# EAGLE design 4xthermocoupleshield (EAGLE 7.5.0)
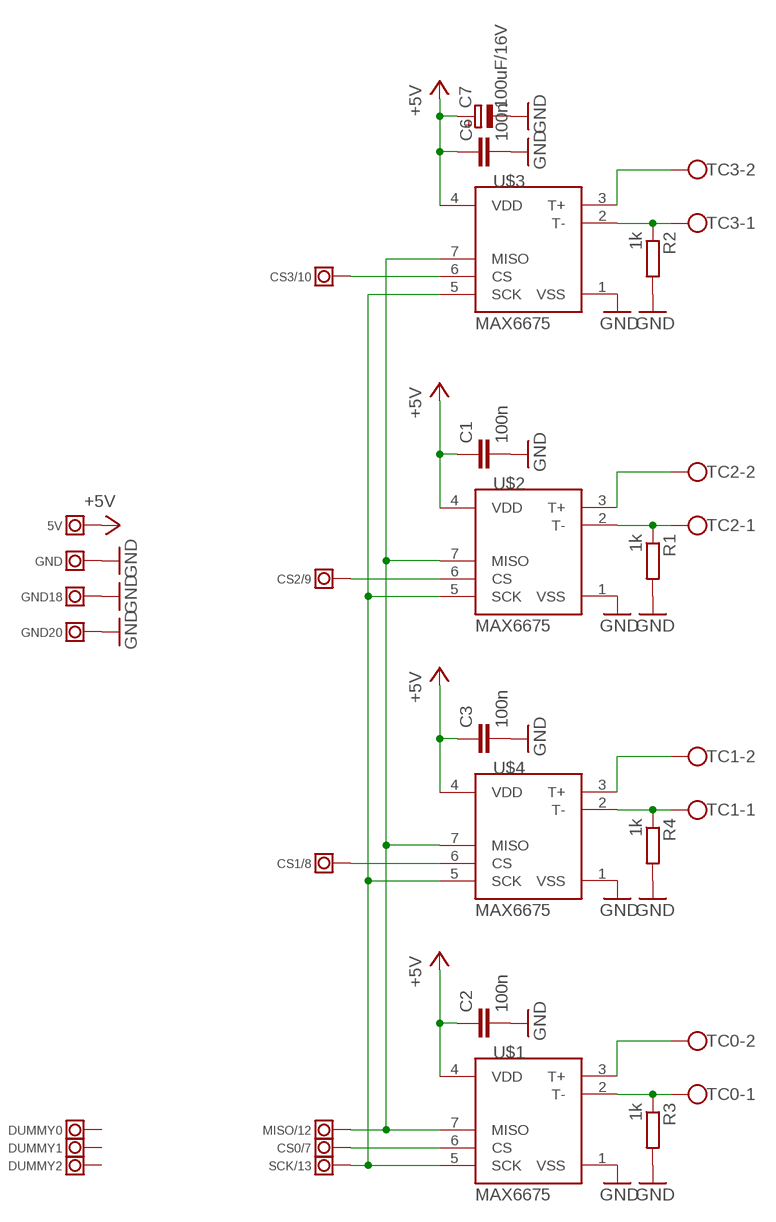
[diagram p0: schematic, sheet 1]

## Parts
5V  PIN-HEADER  [PIN-HEADER-MALE]
C1  100n  C-EUC0603  [C0603]
C2  100n  C-EUC0603  [C0603]
C3  100n  C-EUC0603  [C0603]
C6  100n  C-EUC0603  [C0603]
C7  100uF/16V  CPOL-EUE2.5-7  [E2,5-7]
CS0/7  PIN-HEADER  [PIN-HEADER-MALE]
CS1/8  PIN-HEADER  [PIN-HEADER-MALE]
CS2/9  PIN-HEADER  [PIN-HEADER-MALE]
CS3/10  PIN-HEADER  [PIN-HEADER-MALE]
DUMMY0  PIN-HEADER  [PIN-HEADER-MALE]
DUMMY1  PIN-HEADER  [PIN-HEADER-MALE]
DUMMY2  PIN-HEADER  [PIN-HEADER-MALE]
GND  PIN-HEADER  [PIN-HEADER-MALE]
GND18  PIN-HEADER  [PIN-HEADER-MALE]
GND20  PIN-HEADER  [PIN-HEADER-MALE]
MISO/12  PIN-HEADER  [PIN-HEADER-MALE]
R1  1k  R-EU_R0603  [R0603]
R2  1k  R-EU_R0603  [R0603]
R3  1k  R-EU_R0603  [R0603]
R4  1k  R-EU_R0603  [R0603]
SCK/13  PIN-HEADER  [PIN-HEADER-MALE]
TC0  W237-102  [W237-102]
TC1  W237-102  [W237-102]
TC2  W237-102  [W237-102]
TC3  W237-102  [W237-102]
U$1  MAX6675  [SO08-MAX6675]
U$2  MAX6675  [SO08-MAX6675]
U$3  MAX6675  [SO08-MAX6675]
U$4  MAX6675  [SO08-MAX6675]

## Nets
+5V: 5V.P$1 C1.1 C2.1 C3.1 C6.1 C7.+ U$1.4(VDD) U$2.4(VDD) U$3.4(VDD) U$4.4(VDD)
GND: C1.2 C2.2 C3.2 C6.2 C7.- GND18.P$1 GND20.P$1 GND.P$1 R1.2 R2.2 R3.2 R4.2 U$1.1(VSS) U$2.1(VSS) U$3.1(VSS) U$4.1(VSS)
N$1: TC0.2 U$1.3(T+)
N$2: R1.1 TC2.1 U$2.2(T-)
N$4: TC2.2 U$2.3(T+)
N$6: CS2/9.P$1 U$2.6(CS)
N$9: R2.1 TC3.1 U$3.2(T-)
N$10: MISO/12.P$1 U$1.7(MISO) U$2.7(MISO) U$3.7(MISO) U$4.7(MISO)
N$13: R3.1 TC0.1 U$1.2(T-)
N$14: CS0/7.P$1 U$1.6(CS)
N$16: SCK/13.P$1 U$1.5(SCK) U$2.5(SCK) U$3.5(SCK) U$4.5(SCK)
N$17: TC3.2 U$3.3(T+)
N$18: R4.1 TC1.1 U$4.2(T-)
N$19: CS3/10.P$1 U$3.6(CS)
N$20: TC1.2 U$4.3(T+)
N$22: CS1/8.P$1 U$4.6(CS)
Unconnected: DUMMY0.P$1 DUMMY1.P$1 DUMMY2.P$1

## Library data of the parts
5V CS0/7 CS1/8 CS2/9 CS3/10 DUMMY0 DUMMY1 DUMMY2 GND GND18 GND20 MISO/12 SCK/13 = mrrcomps:PIN-HEADER
C1-C3 C6 = rcl:C-EU: CAPACITOR, European symbol
C7 = rcl:CPOL-EU: POLARIZED CAPACITOR, European symbol
R1-R4 = rcl:R-EU_: RESISTOR, European symbol
TC0 TC1-TC3 = mrrcomps:W237-102: WAGO SCREW CLAMP
U$1-U$4 = SparkFun-AnalogIC:MAX6675: K-type thermocouple ADC, SPI output

## Net classes
2 gnd: width 0.203 mm, drill 0.559 mm, clearance 0.203 mm

## Board
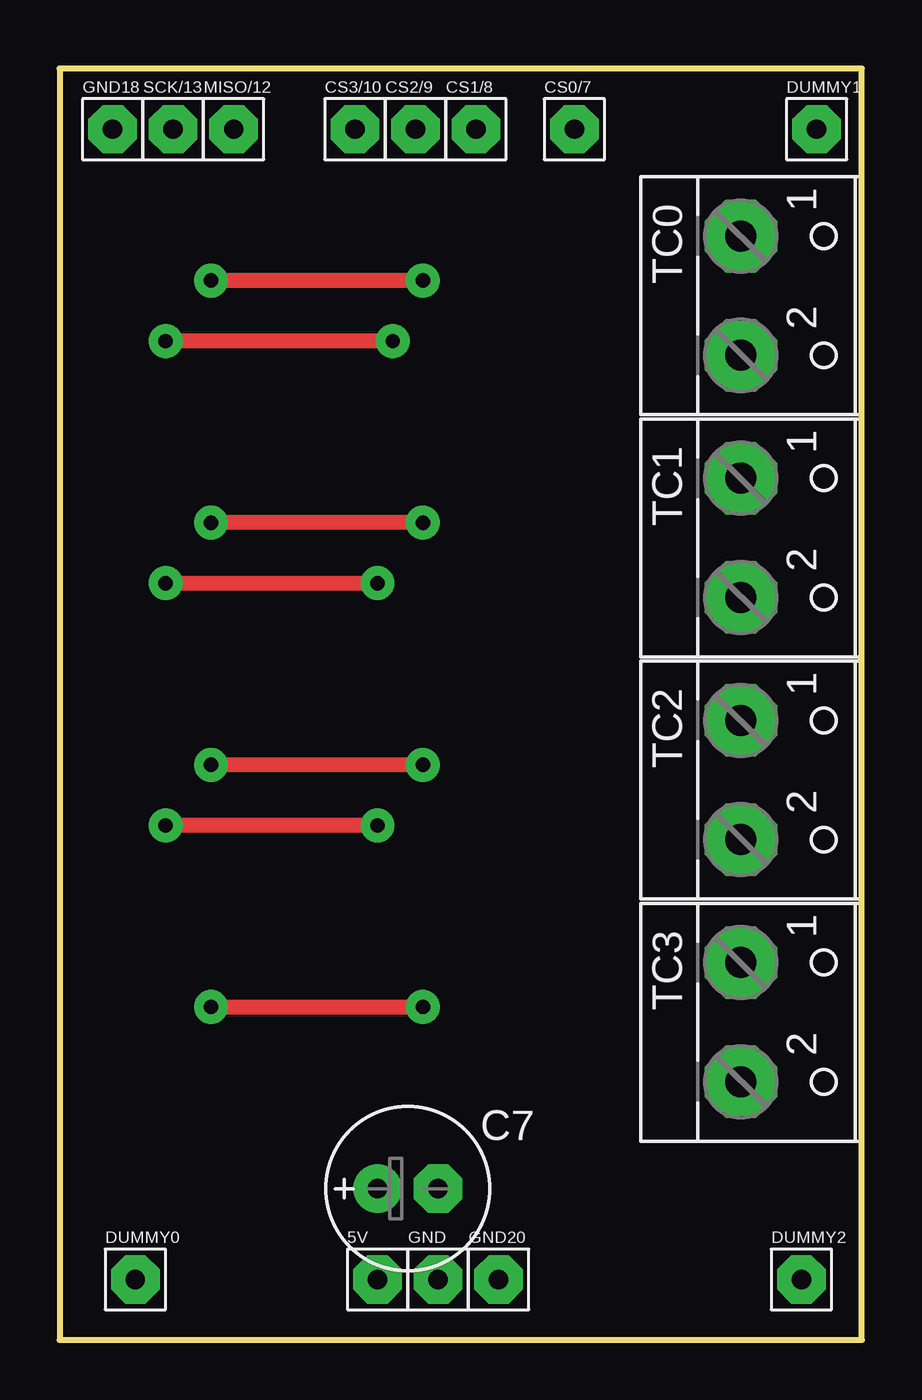
[diagram p1: board, top side]
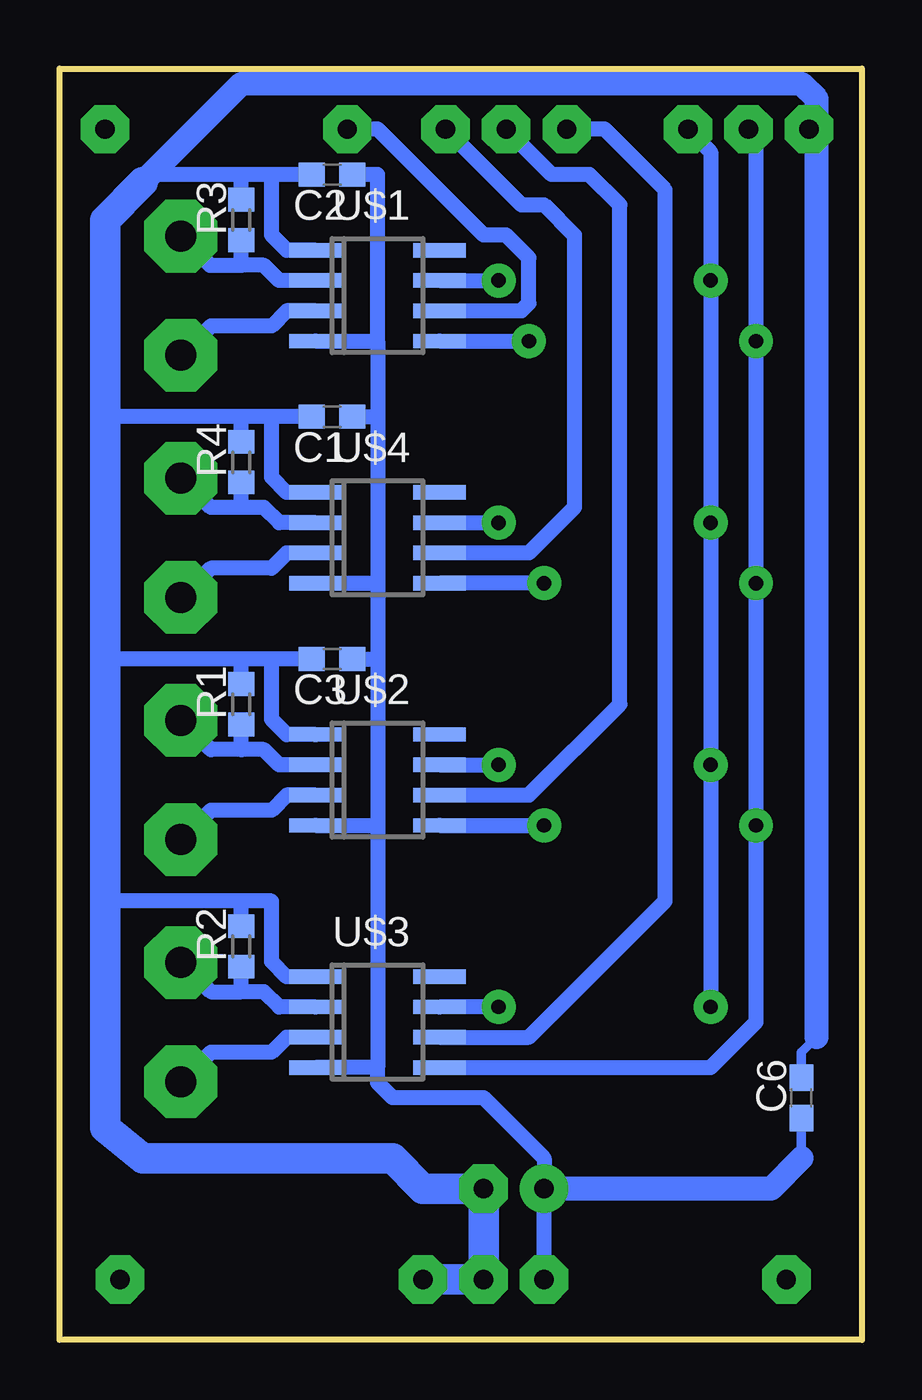
[diagram p2: board, bottom side, seen from below]

Size 33.66 x 53.34 mm. Coordinates in mm from the lower left corner, seen from the top.
Outline: 33.66,53.34 0,53.34 0,0 33.66,0 33.66,53.34
Copper layers (1*16): Top 0.035mm / dielectric 1.5mm / Bottom 0.035mm
Design rules "ArduinoUno *": minimum track width 12mil, minimum drill 32mil, track to track 12mil, track to pad 12mil, pad to pad 12mil, via to via 12mil, smd to smd 12mil, copper to edge 32mil, drill to drill 16mil, minimum pad ring 10mil, minimum via ring 10mil, stop-mask expansion 2mil, vias tented up to drill 30mil, thermal gap 10mil

### Footprints (pad centres in the part's own frame; a part is rotated, then mirrored left to right if it is on the bottom)
PIN-HEADER-MALE = drill 0.813 pad 2.032 octagon: P$1 0,0
C0603 = smd 1.1 x 1: 1 -0.85,0; 2 0.85,0
E2,5-7 = drill 0.813 pad 2.032: + -1.27,0 | drill 0.813 pad 2.032 octagon: - 1.27,0
R0603 = smd 1 x 1.1: 1 -0.85,0; 2 0.85,0
W237-102 = drill 1.3 pad 3.048 octagon: 1 -2.5,-1.27; 2 2.5,-1.27
SO08-MAX6675 = smd 0.6 x 2.2: 1 -1.905,-2.6; 2 -0.635,-2.6; 3 0.635,-2.6; 4 1.905,-2.6; 5 1.905,2.6; 6 0.635,2.6; 7 -0.635,2.6; 8 -1.905,2.6

### Placement (x,y rotation side)
5V  13.34,2.54 0 top
C1  22.23,38.73 180 bottom
C2  22.23,48.9 180 bottom
C3  22.23,28.57 180 bottom
C6  2.54,10.16 90 bottom
C7  14.61,6.35 0 top
CS0/7  21.59,50.8 0 top
CS1/8  17.46,50.8 0 top
CS2/9  14.92,50.8 0 top
CS3/10  12.38,50.8 0 top
DUMMY0  3.17,2.54 0 top
DUMMY1  31.75,50.8 0 top
DUMMY2  31.11,2.54 0 top
GND  15.88,2.54 0 top
GND18  2.22,50.8 0 top
GND20  18.41,2.54 0 top
MISO/12  7.3,50.8 0 top
R1  26.04,26.67 90 bottom
R2  26.04,16.51 90 bottom
R3  26.04,46.99 90 bottom
R4  26.04,36.83 90 bottom
SCK/13  4.76,50.8 0 top
TC0  29.84,43.81 270 top
TC1  29.84,33.66 270 top
TC2  29.84,23.5 270 top
TC3  29.84,13.34 270 top
U$1  20.32,43.81 270 bottom
U$2  20.32,23.5 270 bottom
U$3  20.32,13.34 270 bottom
U$4  20.32,33.66 270 bottom

### Tracks (layer width: path | path; a pad name or v marks a point on that pad's centre or on a via)
+5V
  Bottom 0.406: C6.1 2.54,7.62
  Bottom 0.635: 20.32,11.43 20.32,10.79 19.68,10.16 15.88,10.16 13.34,7.62 C7.+ 5V.P$1 | 20.32,11.43 U$3.4 | U$2.4 20.32,21.59 | 20.32,21.59 20.32,11.43 | U$4.4 20.32,31.75 | 20.32,31.75 20.32,28.57 | 20.32,28.57 20.32,21.59 | U$1.4 20.32,41.91 | 20.32,41.91 20.32,38.73 | 20.32,38.73 20.32,31.75 | 20.32,41.91 20.32,48.9 C2.1 | C1.1 20.32,38.73 | C3.1 20.32,28.57
  Bottom 1.016: 2.54,7.62 3.81,6.35 C7.+
GND
  Bottom 0.406: GND18.P$1 1.91,50.8 | C6.2 2.54,12.06 1.91,12.7
  Bottom 0.635: 26.04,18.41 24.77,18.41 24.77,15.88 24.13,15.24 U$3.1 | 26.04,18.41 31.75,18.41 | R2.2 26.04,18.41 | U$2.1 24.13,25.4 24.77,26.04 24.77,28.57 | 24.77,28.57 26.04,28.57 | 26.04,28.57 31.75,28.57 | R1.2 26.04,28.57 | C3.2 24.77,28.57 | U$4.1 24.13,35.56 24.77,36.2 24.77,38.73 | 24.77,38.73 26.04,38.73 | 26.04,38.73 31.75,38.73 | R4.2 26.04,38.73 | C1.2 24.77,38.73 | U$1.1 24.13,45.72 24.77,46.35 24.77,48.9 | 24.77,48.9 26.04,48.9 | 26.04,48.9 29.84,48.9 30.16,48.58 | R3.2 26.04,48.9 | C2.2 24.77,48.9
  Bottom 1.016: 29.84,48.9 26.04,52.7 2.54,52.7 1.91,52.07 1.91,50.8 1.91,12.7
  Bottom 1.27: GND20.P$1 GND.P$1 C7.- 18.41,6.35 19.68,7.62 30.16,7.62 31.75,8.89 31.75,18.41 31.75,28.57 31.75,38.73 31.75,46.99 30.16,48.58
N$1
  Bottom 0.635: U$1.3 24.13,43.18 24.77,42.55 27.3,42.55 28.54,41.31 TC0.2
N$2
  Bottom 0.635: U$2.2 24.45,24.13 25.08,24.77 26.04,24.77 | 26.04,24.77 27.3,24.77 28.54,26 TC2.1 | 26.04,24.77 R1.1
N$4
  Bottom 0.635: U$2.3 24.13,22.86 24.77,22.23 27.3,22.23 28.54,21 TC2.2
N$6
  Bottom 0.635: U$2.6 13.97,22.86 10.16,26.67 10.16,47.62 11.43,48.9 13.02,48.9 CS2/9.P$1
N$9
  Bottom 0.635: U$3.2 24.45,13.97 25.08,14.61 26.04,14.61 | TC3.1 28.54,15.84 27.3,14.61 26.04,14.61 | 26.04,14.61 R2.1
N$10  (via drill 0.6 pad 1.42)
  Top 0.635: v15.24,44.45 v6.35,44.45 | v6.35,13.97 v15.24,13.97 | v15.24,24.13 v6.35,24.13 | v15.24,34.29 v6.35,34.29
  Bottom 0.635: U$1.7 v15.24,44.45 | MISO/12.P$1 6.35,49.85 v6.35,44.45 v6.35,34.29 v6.35,24.13 v6.35,13.97 | v15.24,13.97 U$3.7 | U$2.7 v15.24,24.13 | U$4.7 v15.24,34.29
N$13
  Bottom 0.635: U$1.2 24.45,44.45 25.08,45.09 26.04,45.09 | 26.04,45.09 R3.1 | TC0.1 27.34,45.09 26.04,45.09
N$14
  Bottom 0.635: U$1.6 14.29,43.18 13.97,43.5 13.97,45.4 14.92,46.35 15.88,46.35 20.32,50.8 CS0/7.P$1
N$16  (via drill 0.6 pad 1.42)
  Top 0.635: v13.97,41.91 v4.45,41.91 | v13.34,21.59 v4.45,21.59 | v4.45,31.75 v13.34,31.75
  Bottom 0.635: U$1.5 v13.97,41.91 | U$2.5 v13.34,21.59 | SCK/13.P$1 4.76,50.48 4.45,50.16 v4.45,41.91 v4.45,31.75 v4.45,21.59 4.45,13.34 6.35,11.43 U$3.5 | v13.34,31.75 U$4.5
N$17
  Bottom 0.635: U$3.3 24.13,12.7 24.77,12.06 27.3,12.06 28.54,10.84 TC3.2
N$18
  Bottom 0.635: U$4.2 24.45,34.29 25.08,34.92 26.04,34.92 | 26.04,34.92 27.3,34.92 28.54,36.16 TC1.1 | 26.04,34.92 R4.1
N$19
  Bottom 0.635: U$3.6 13.97,12.7 8.26,18.41 8.26,48.26 10.79,50.8 CS3/10.P$1
N$20
  Bottom 0.635: U$4.3 24.13,33.02 24.77,32.38 27.3,32.38 28.54,31.16 TC1.2
N$22
  Bottom 0.635: CS1/8.P$1 14.29,47.62 13.34,47.62 12.06,46.35 12.06,34.92 13.97,33.02 U$4.6